# Altium project DebreczeniLaszloA27.PrjPcb
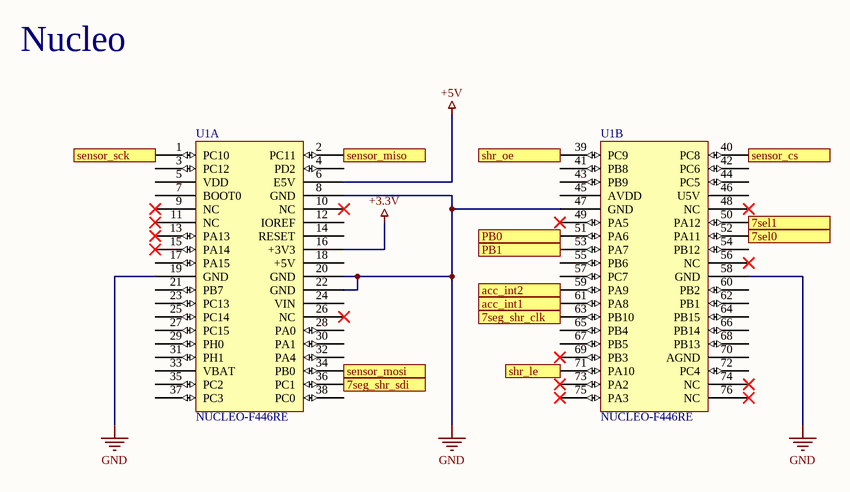
[diagram p0: Nucleo.SchDoc]
5 sheets, 33 parts. Net scope: flat (ports and power ports of the same name join across sheets).
Board file: hazi_kiindulas.PcbDoc
Sheets:
  Nucleo.SchDoc
  7segment.SchDoc
  Power.SchDoc
  Acceleration_module.SchDoc
  Pushbuttons.SchDoc

## Sheet Nucleo.SchDoc: Nucleo kártya
size A4; Author: Debreczeni László; Organization: BME-AUT; DocumentNumber: 1; Revision: A27; SheetNumber: 1; SheetTotal: 5

### Parts
U1  NUCLEO-F446RE  [FP_NUCLEO-64]  (parts A,B of 2)

### Ports
7seg_shr_clk (out), 7seg_shr_sdi (out), 7sel0 (out), 7sel1 (out), acc_int1 (in), acc_int2 (in), PB0 (in), PB1 (in), sensor_cs (out), sensor_miso (in), sensor_mosi (out), sensor_sck (out), shr_le (out), shr_oe (out)

### Nets
+3.3V: U1.16(+3V3)
+5V: U1.6(E5V)
GND: U1.8(GND) U1.19(GND) U1.20(GND) U1.22(GND) U1.47(GND) U1.58(GND)
NetC4_2: U1.51(PA6) ; port PB0
NetC5_2: U1.53(PA7) ; port PB1
NetU1_1: U1.1(PC10) ; port sensor_sck
NetU1_2: U1.2(PC11) ; port sensor_miso
NetU1_34: U1.34(PB0) ; port sensor_mosi
NetU1_36: U1.36(PC1) ; port 7seg_shr_sdi
NetU1_39: U1.39(PC9) ; port shr_oe
NetU1_40: U1.40(PC8) ; port sensor_cs
NetU1_50: U1.50(PA12) ; port 7sel1
NetU1_52: U1.52(PA11) ; port 7sel0
NetU1_59: U1.59(PA9) ; port acc_int2
NetU1_61: U1.61(PA8) ; port acc_int1
NetU1_63: U1.63(PB10) ; port 7seg_shr_clk
NetU1_71: U1.71(PA10) ; port shr_le

Not connected (* = marked no-connect by the designer): U1 3(PC12) 4(PD2) 5(VDD) 7(BOOT0) 9(NC)* 10(NC)* 11(NC)* 12(IOREF) 13(PA13)* 14(RESET) 15(PA14)* 17(PA15) 18(+5V) 21(PB7) 23(PC13) 24(VIN) 25(PC14) 26(NC)* 27(PC15) 28(PA0) 29(PH0) 30(PA1) 31(PH1) 32(PA4) 33(VBAT) 35(PC2) 37(PC3) 38(PC0) 41(PB8) 42(PC6) 43(PB9) 44(PC5) 45(AVDD) 46(U5V) 48(NC)* 49(PA5)* 54(PB12) 55(PB6) 56(NC)* 57(PC7) 60(PB2) 62(PB1) 64(PB15) 65(PB4) 66(PB14) 67(PB5) 68(PB13) 69(PB3)* 70(AGND) 72(PC4) 73(PA2)* 74(NC)* 75(PA3)* 76(NC)*

### Notes on the sheet
- Nucleo
- Title
- Size:
- Date:
- A4
- Number:
- Time:
- Revision:
- Sheet
- of
- File:

### Library data of the parts
U1 = NUCLEO-F446RE: Reference: NUCLEO; Name: Nucleo F446RE; Supplier: Tanszék

## Sheet 7segment.SchDoc: 7 szegmens kijelzők
size A4; Author: Debreczeni László; Organization: BME-AUT; DocumentNumber: 2; Revision: A27; SheetNumber: 2; SheetTotal: 5
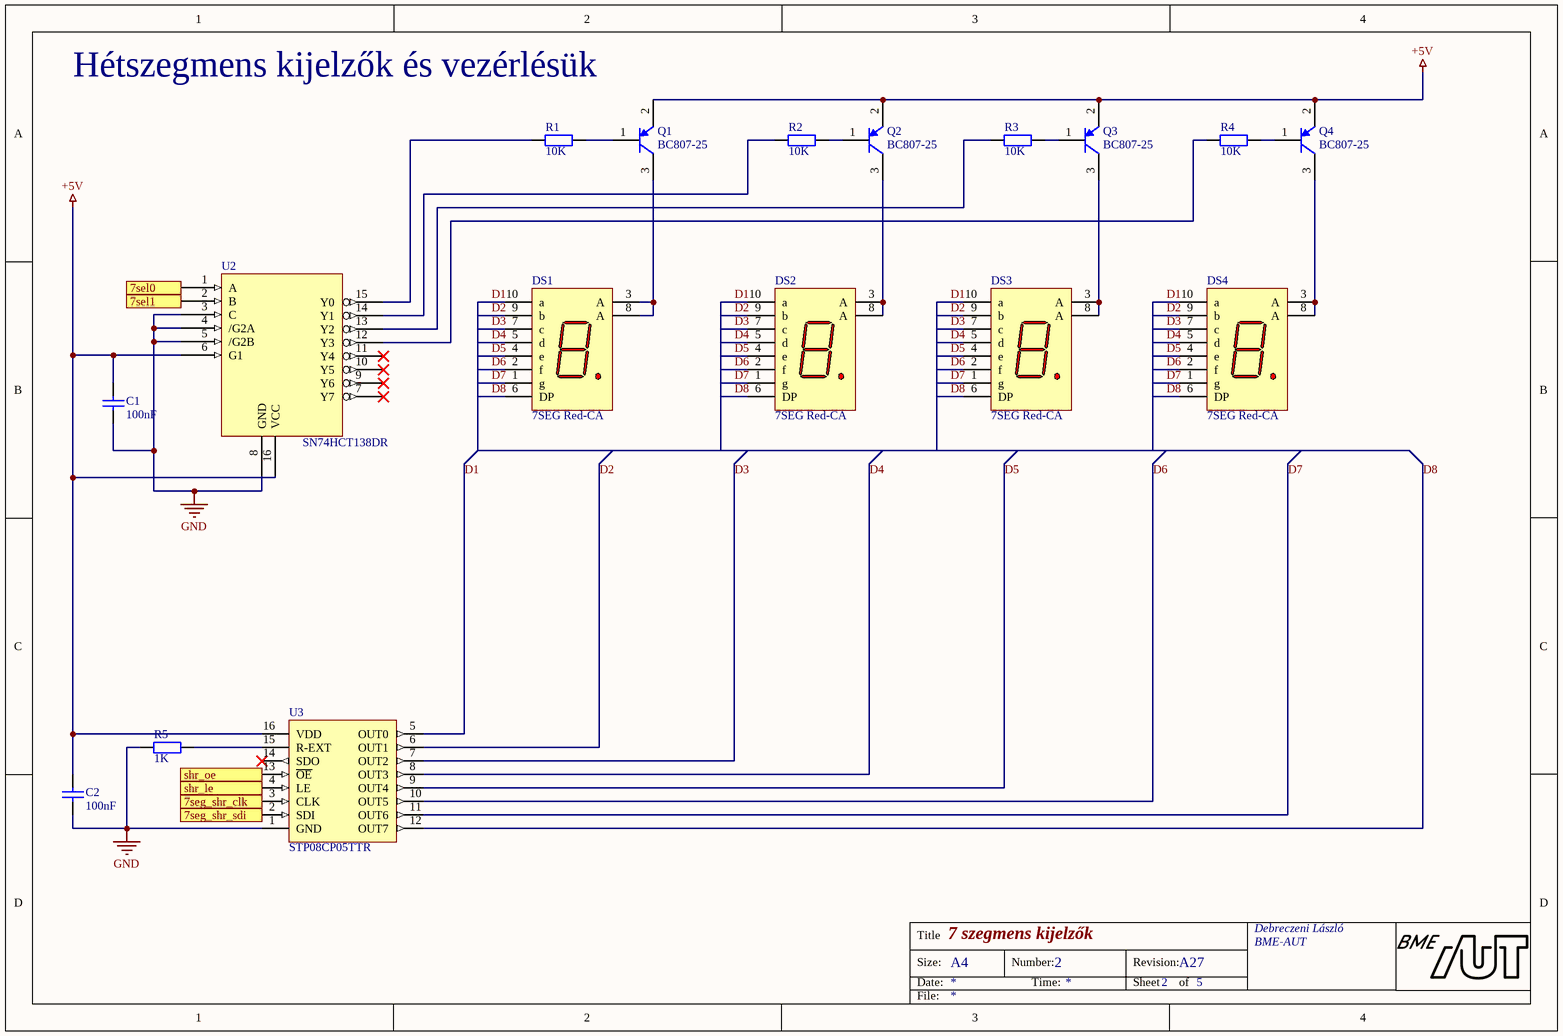
[diagram p1: 7segment.SchDoc]

### Parts
C1  100nF  [FP_1206_CAP_125]
C2  100nF  [FP_1206_CAP_125]
DS1  7SEG Red-CA  [FP_7SEG]
DS2  7SEG Red-CA  [FP_7SEG]
DS3  7SEG Red-CA  [FP_7SEG]
DS4  7SEG Red-CA  [FP_7SEG]
Q1  BC807-25  [SOT95P240X115-3M]
Q2  BC807-25  [SOT95P240X115-3M]
Q3  BC807-25  [SOT95P240X115-3M]
Q4  BC807-25  [SOT95P240X115-3M]
R1  10K  [FP_1206_RES]
R2  10K  [FP_1206_RES]
R3  10K  [FP_1206_RES]
R4  10K  [FP_1206_RES]
R5  1K  [FP_1206_RES]
U2  SN74HCT138DR  [SOIC127P600X175-16M]
U3  STP08CP05TTR  [TSOP65P640X120-16M]

### Ports
7seg_shr_clk (in), 7seg_shr_sdi (in), 7sel0 (in), 7sel1 (in), shr_le (in), shr_oe (in)

### Nets
+5V: C1.2 C2.2 Q1.2(E) Q2.2(E) Q3.2(E) Q4.2(E) U2.6(G1) U2.16(VCC) U3.16(VDD)
GND: C1.1 C2.1 R5.1 U2.3(C) U2.4(/G2A) U2.5(/G2B) U2.8(GND) U3.1(GND)
D1: DS1.10(a) DS2.10(a) DS3.10(a) DS4.10(a) U3.5(OUT0)
D2: DS1.9(b) DS2.9(b) DS3.9(b) DS4.9(b) U3.6(OUT1)
D3: DS1.7(c) DS2.7(c) DS3.7(c) DS4.7(c) U3.7(OUT2)
D4: DS1.5(d) DS2.5(d) DS3.5(d) DS4.5(d) U3.8(OUT3)
D5: DS1.4(e) DS2.4(e) DS3.4(e) DS4.4(e) U3.9(OUT4)
D6: DS1.2(f) DS2.2(f) DS3.2(f) DS4.2(f) U3.10(OUT5)
D7: DS1.1(g) DS2.1(g) DS3.1(g) DS4.1(g) U3.11(OUT6)
D8: DS1.6(DP) DS2.6(DP) DS3.6(DP) DS4.6(DP) U3.12(OUT7)
NetDS1_3: DS1.3(A) DS1.8(A) Q1.3(C)
NetDS2_3: DS2.3(A) DS2.8(A) Q2.3(C)
NetDS3_3: DS3.3(A) DS3.8(A) Q3.3(C)
NetDS4_3: DS4.3(A) DS4.8(A) Q4.3(C)
NetQ1_1: Q1.1(B) R1.2
NetQ2_1: Q2.1(B) R2.2
NetQ3_1: Q3.1(B) R3.2
NetQ4_1: Q4.1(B) R4.2
NetR1_1: R1.1 U2.15(Y0)
NetR2_1: R2.1 U2.14(Y1)
NetR3_1: R3.1 U2.13(Y2)
NetR4_1: R4.1 U2.12(Y3)
NetR5_2: R5.2 U3.15(R-EXT)
NetU1_36: U3.2(SDI) ; port 7seg_shr_sdi
NetU1_39: U3.13(~{OE}) ; port shr_oe
NetU1_50: U2.2(B) ; port 7sel1
NetU1_52: U2.1(A) ; port 7sel0
NetU1_63: U3.3(CLK) ; port 7seg_shr_clk
NetU1_71: U3.4(LE) ; port shr_le

Not connected (* = marked no-connect by the designer): U2 7(Y7)* 9(Y6)* 10(Y5)* 11(Y4)*; U3 14(SDO)*

### Notes on the sheet
- Hétszegmens kijelzők és vezérlésük
- Title
- Size:
- Date:
- A4
- Number:
- Time:
- Revision:
- Sheet
- of
- File:

### Library data of the parts
C1 C2 = CAP: Capacitor; Tolerance: 10%; Voltage: 50V; Name: 100nF 1206 Capacitor; Supplier: Lomex; Reference: 82-14-64; Value: 100nF
DS1-DS4 = 7SEG Red-CA: 7-Segment Display: CA, RH DP; MinimumIntensity: 360 ucd; Note: IF = 5 mA; Colour: High Efficiency Red (HER); Note: Pins 1 and 6 are redundant Anodes.; Name: FYS-3911BUHR-21; Published: 8-Jun-2000; LatestRevisionDate: 17-Dec-2003; LatestRevisionNote: Schematic revised, PCB Footprint replaced.; DatasheetVersion: 19-Feb-2002; PackageVersion: 11-Feb-2002; PackageReference: A; Publisher: Altium Limited; PackageDescription: LED, 7-Segment Display, 7.62 mm, RHD; 10 Leads; Row Space 5.08 mm; Pitch 2.54 mm; ComponentLink1Description: Manufacturer Link; ComponentLink1URL: http://www.agilent.com/; Supplier: Lomex; Reference: 35-03-94
Q1-Q4 = BC807-25: PNP General-purpose Transistor; Supplier: Lomex; Reference: 86-05-63; Name: BC807-25
R1-R4 = RES: Resistor; Tolerance: 5%; Power: 0.25W; Name: 10K 1206 Resistor; Supplier: Lomex; Reference: 81-11-59; Value: 10K
R5 = RES: Resistor; Tolerance: 5%; Power: 0.25W; Name: 1K 1206 Resistor; Supplier: Lomex; Reference: 81-11-47; Value: 1K
U2 = SN74HCT138DR: 3-line to 8-line decoder; Supplier: Lomex; Reference: 87-06-49; Name: SN74HCT138DR
U3 = STP08CP05TTR: Low voltage, low current power 8-bit shift register; Supplier: ST, Tanszéki forrás; Name: STP08CP05TTR

## Sheet Power.SchDoc: Tápellátás
size A4; Author: Debreczeni László; Organization: BME-AUT; DocumentNumber: 3; Revision: A27; SheetNumber: 3; SheetTotal: 5
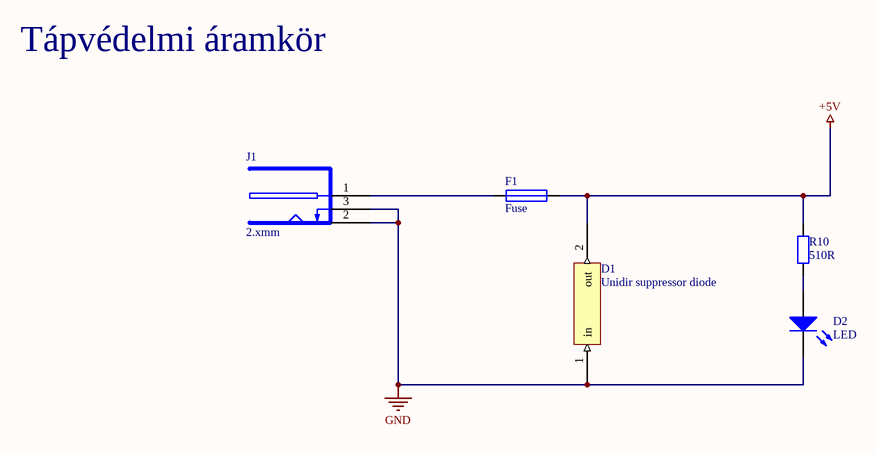
[diagram p2: Power.SchDoc]

### Parts
D1  Unidir suppressor diode  [DIOM4426X23M]
D2  LED  [FP_0805_LED_RED]
F1  Fuse  [FP_MULTIFUSE]
J1  2.xmm  [FP_DC_TAP_ANYA]
R10  510R  [FP_1206_RES]

### Nets
+5V: D1.2(out) F1.2 R10.2
GND: D1.1(in) D2.2(K) J1.2(SLEEVE) J1.3(BREAK)
NetD2_1: D2.1(A) R10.1
NetF1_1: F1.1 J1.1(PIN)

### Notes on the sheet
- Tápvédelmi áramkör
- Title
- Size:
- Date:
- A4
- Number:
- Time:
- Revision:
- Sheet
- of
- File:

### Library data of the parts
D1 = Suppressor diode: Suppressor diode for transients; Supplier: Lomex; Reference: 96-03-85; Name: Suppressor diode
D2 = LED: Typical RED GaAs LED; pin to pad: 1>A 2>K; U_fw: 5 V; I_max: 30 mA; Name: Green LED; Supplier: Lomex; Reference: 95-02-77
F1 = Fuse: Name: SMD Fuse; Reference: 44-04-71; Supplier: Lomex
J1 = DC_TAP_ANYA: 2.xmm DC HEBA25 TÁPFESZÜLTSÉG ALJZAT ZÁRT, NYÁKBA 90°; Name: TÁP DC ANYA 5.5/2.1/9.5mm DCS-5521-5; Supplier: Lomex; Reference: 43-07-67
R10 = RES: Resistor; Tolerance: 5%; Power: 0.25W; Name: 1206 Resistor; Supplier: Lomex; Reference: 81-12-04; Value: 510R

## Sheet Acceleration_module.SchDoc: Gyorsulásérzékelő modul
size A4; Author: Debreczeni László; Organization: BME-AUT; DocumentNumber: 4; Revision: A27; SheetNumber: 4; SheetTotal: 5
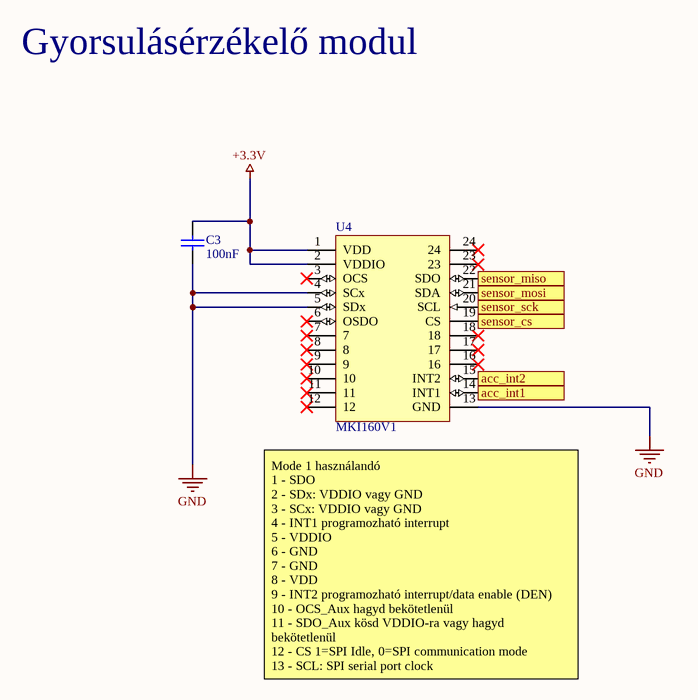
[diagram p3: Acceleration_module.SchDoc]

### Parts
C3  100nF  [FP_1206_CAP_125]
U4  MKI160V1  [FP_DIL24]

### Ports
acc_int1 (out), acc_int2 (out), sensor_cs (in), sensor_miso (out), sensor_mosi (in), sensor_sck (in)

### Nets
+3.3V: C3.2 U4.1(VDD) U4.2(VDDIO)
GND: C3.1 U4.4(SCx) U4.5(SDx) U4.13(GND)
NetU1_1: U4.20(SCL) ; port sensor_sck
NetU1_2: U4.22(SDO) ; port sensor_miso
NetU1_34: U4.21(SDA) ; port sensor_mosi
NetU1_40: U4.19(CS) ; port sensor_cs
NetU1_59: U4.15(INT2) ; port acc_int2
NetU1_61: U4.14(INT1) ; port acc_int1

Not connected (* = marked no-connect by the designer): U4 3(OCS)* 6(OSDO)* 7* 8* 9* 10* 11* 12* 16* 17* 18* 23* 24*

### Notes on the sheet
- Gyorsulásérzékelő modul
- (near U4) Mode 1 használandó
  1 - SDO
  2 - SDx: VDDIO vagy GND
  3 - SCx: VDDIO vagy GND
  4 - INT1 programozható interrupt
  5 - VDDIO
  6 - GND
  7 - GND
  8 - VDD
  9 - INT2 programozható interrupt/data enable (DEN)
  10 - OCS_Aux hagyd bekötetlenül
  11 - SDO_Aux kösd VDDIO-ra vagy hagyd bekötetlenül
  12 - CS 1=SPI Idle, 0=SPI communication mode
  13 - SCL: SPI serial port clock
  14 - SDA: SDI/3-wire interface SDO
- Title
- Size:
- Date:
- A4
- Number:
- Time:
- Revision:
- Sheet
- of
- File:

### Library data of the parts
C3 = CAP: as C1 on sheet 7segment; Supplier: Lomex; Reference: 82-14-64; Value: 100nF
U4 = MKI160V1: LSM6DS3 inertial module adapter; Name: MKI160V1 LSM6DS3 inertial module adapter; Reference: 511-STEVAL-MKI160V1; Supplier: Mouser

## Sheet Pushbuttons.SchDoc: Nyomógombok
size A4; Author: Debreczeni László; Organization: BME-AUT; DocumentNumber: 5; Revision: A27; SheetNumber: 5; SheetTotal: 5
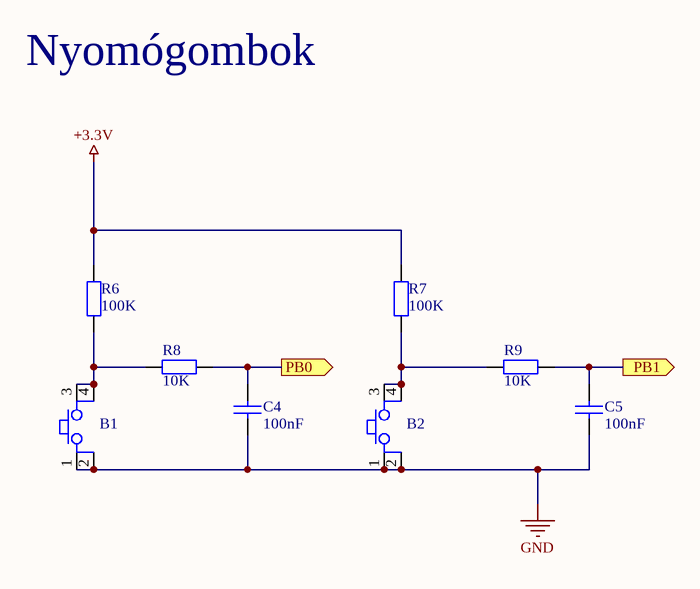
[diagram p4: Pushbuttons.SchDoc]

### Parts
B1  Button  [FP_BTN_SMD]  (value not drawn)
B2  Button  [FP_BTN_SMD]  (value not drawn)
C4  100nF  [FP_1206_CAP_125]
C5  100nF  [FP_1206_CAP_125]
R6  100K  [FP_1206_RES]
R7  100K  [FP_1206_RES]
R8  10K  [FP_1206_RES]
R9  10K  [FP_1206_RES]

### Ports
PB0 (out), PB1 (out)

### Nets
+3.3V: R6.2 R7.2
GND: B1.1 B1.2 B2.1 B2.2 C4.1 C5.1
NetB1_3: B1.3 B1.4 R6.1 R8.1
NetB2_3: B2.3 B2.4 R7.1 R9.1
NetC4_2: C4.2 R8.2 ; port PB0
NetC5_2: C5.2 R9.2 ; port PB1

### Notes on the sheet
- Nyomógombok
- Title
- Size:
- Date:
- A4
- Number:
- Time:
- Revision:
- Sheet
- of
- File:

### Library data of the parts
B1 B2 = Button 4P: Push button; Name: 4P Pushbutton; Reference: 45-05-43; Supplier: Lomex
C4 C5 = CAP: as C1 on sheet 7segment; Supplier: Lomex; Reference: 82-14-64; Value: 100nF
R6 R7 = RES: Resistor; Tolerance: 5%; Power: 0.25W; Name: 100K 1206 resistor; Supplier: Lomex; Reference: 81-11-71; Value: 100K
R8 R9 = RES: as R1 on sheet 7segment; Supplier: Lomex; Reference: 81-11-59; Value: 10K

## Nets that join several sheets
+3.3V: Nucleo (U1.16), Acceleration_module (C3.2 U4.1 U4.2), Pushbuttons (R6.2 R7.2)
+5V: Nucleo (U1.6), 7segment (9 pins), Power (D1.2 F1.2 R10.2)
GND: Nucleo (6 pins), 7segment (8 pins), Power (D1.1 D2.2 J1.2 J1.3), Acceleration_module (C3.1 U4.4 U4.5 U4.13), Pushbuttons (6 pins)
NetC4_2: Nucleo (U1.51), Pushbuttons (C4.2 R8.2)
NetC5_2: Nucleo (U1.53), Pushbuttons (C5.2 R9.2)
NetU1_1: Nucleo (U1.1), Acceleration_module (U4.20)
NetU1_2: Nucleo (U1.2), Acceleration_module (U4.22)
NetU1_34: Nucleo (U1.34), Acceleration_module (U4.21)
NetU1_36: Nucleo (U1.36), 7segment (U3.2)
NetU1_39: Nucleo (U1.39), 7segment (U3.13)
NetU1_40: Nucleo (U1.40), Acceleration_module (U4.19)
NetU1_50: Nucleo (U1.50), 7segment (U2.2)
NetU1_52: Nucleo (U1.52), 7segment (U2.1)
NetU1_59: Nucleo (U1.59), Acceleration_module (U4.15)
NetU1_61: Nucleo (U1.61), Acceleration_module (U4.14)
NetU1_63: Nucleo (U1.63), 7segment (U3.3)
NetU1_71: Nucleo (U1.71), 7segment (U3.4)